# EAGLE schematic question_4 (EAGLE 8.2.2)
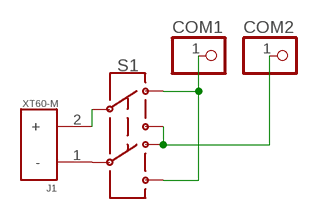
[diagram p0: schematic, sheet 1]

## Parts
COM1  PINHD-1X1  [1X01]
COM2  PINHD-1X1  [1X01]
J1  XT60-M  [AMASS_XT60-M]
S1  SWITCH-DPDT-SMD-AYZ0202  [SWITCH_DPDT_SMD_AYZ0202]

## Nets
N$1: J1.1(-) S1.5
N$2: J1.2(+) S1.2
N$3: COM1.1 S1.1 S1.6
N$4: COM2.1 S1.3 S1.4

## Library data of the parts
COM1 COM2 = adafruit:PINHD-1X1: Pin header 1x1 for 0.1" spacing With round pins
J1 = XT60-M:XT60-M: DC supply; XT60; male; PIN:2; for cable; soldered; 60A; 500V; AVAILABILITY: Unavailable; DESCRIPTION: Plug; DC supply; XT60; male; PIN: 2; for cable; soldered; 30A; 500V; MF: AMASS; MP: XT60-M; PACKAGE: Package; PRICE: None
S1 = SparkFun-Switches:SWITCH-DPDT: Double-Pole, Double-Throw (DPDT) Switch Double-pole, double-throw switches. Variant Overview PTH-GPI-152-3013 Used on SparkFun Geiger Counter <https://www.sparkfun.com/products/11345> SMD-AY0202 Surface Mount DPDT Switch <https://www.sparkfun.com/products/597> (COM-00597) Used on e.g. LilyPad Arduino USB - ATmega32U4 Board <https://www.sparkfun.com/products/12049>; PROD_ID: SWCH-08179; SF_SKU: COM-00597